# Altium schematic sheet isoSPI-transformer.SchDoc
size A3; DocumentNumber: 3; SheetNumber: 3; SheetTotal: 3; SheetDescription: isoSPI Transformer
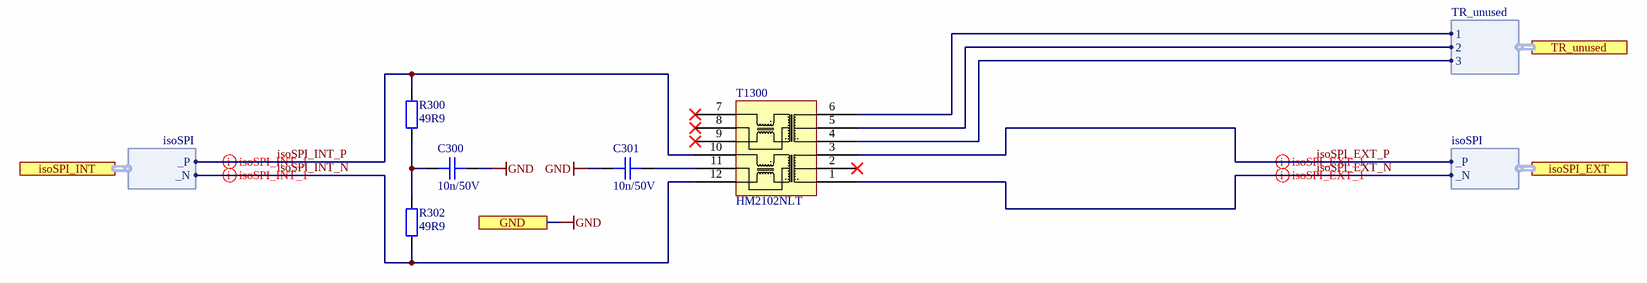
[diagram p0: isoSPI-transformer.SchDoc]

## Parts
C300  10n/50V  [CAPC1608X08N]
C301  10n/50V  [CAPC1608X08N]
R300  49R9  [RESC1608X05N]
R302  49R9  [RESC1608X05N]
T1300  HM2102NLT  [HM2102NL]

## Ports
GND, isoSPI_EXT (harness isoSPI), isoSPI_INT (harness isoSPI), TR_unused (harness TR_unused)

## Harnesses
isoSPI: _P, _N
TR_unused: 1, 2, 3

## Nets
GND: C300.2 C301.1 ; port GND
isoSPI_EXT_N: T1300.1 ; port isoSPI_EXT._N
isoSPI_EXT_P: T1300.3 ; port isoSPI_EXT._P
isoSPI_INT_N: R302.1 T1300.12 ; port isoSPI_INT._N
isoSPI_INT_P: R300.2 T1300.10 ; port isoSPI_INT._P
NetC300_1: C300.1 R300.1 R302.2
NetC301_2: C301.2 T1300.11
NetT1300_4: T1300.4 ; port TR_unused.3
NetT1300_5: T1300.5 ; port TR_unused.2
NetT1300_6: T1300.6 ; port TR_unused.1

Not connected (* = marked no-connect by the designer): T1300 2* 7* 8* 9*

## Layout directives
differential pair: isoSPI_EXT_N, isoSPI_EXT_P, isoSPI_INT_N, isoSPI_INT_P

## Notes on the sheet
- Fraunhofer IISB
- Schottkystr. 10
- developed by:
- 91058 Erlangen
- Germany
- Author
- Project
- License
- Description
- File
- Version
- Release Date
- Sheet
- foxbms.org <https://foxbms.org>
- www.iisb.fraunhofer.de <https://www.iisb.fraunhofer.de/>
- foxBMS Team
- /

## Library data of the parts
C300 C301 = gen_C_ceramic_10n_50V_C0G_0603: MLCC; Capacitance: 10n; Rated Voltage: 50V; Dielectric: C0G; Case EIA: 0603; Case Metric: 1608; Automotive Qualified: True; PnP Package: 0603C; Part Number: gen_C_ceramic_10n_50V_C0G_0603; Supplier 1: Farnell; Supplier Part Number 1: 2210846
R300 R302 = gen_R_49R9_0603: SMD Resistor 49R9 0603; Tolerance: 1%; Power: 0.1W; Case EIA: 0603; Case Metric: 1608; Maximum Working Voltage: 75V; PnP Package: 0603R; Automotive Qualified: True; Part Number: gen_R_49R9_0603; Operating Temperature: -55°C - +155°C; Resistance: 49R9; Series: E96; PnP Value: 49R9; Supplier 1: Digikey; Supplier Part Number 1: P49.9HCT-ND
T1300 = HM2102NLT: Pulse HM2102NLT BMS Transformer; Automotive Qualified: True; AEC-Q Norm: AEC-Q200; Part Number: HM2102NLT; Manufacturer: Pulse; Operating Temperature: -40°C - +125°C; ComponentLink1Description: Datasheet; ComponentLink1URL: https://www.mouser.de/datasheet/2/336/HM2102NL-1218600.pdf; Supplier 1: Mouser; Supplier Part Number 1: 673-HM2102NLT; Supplier 2: Digikey; Supplier Part Number 2: 1840-1034-1-ND; ECCN: EAR99